# EAGLE schematic Exercise1 (EAGLE 6.5.0)
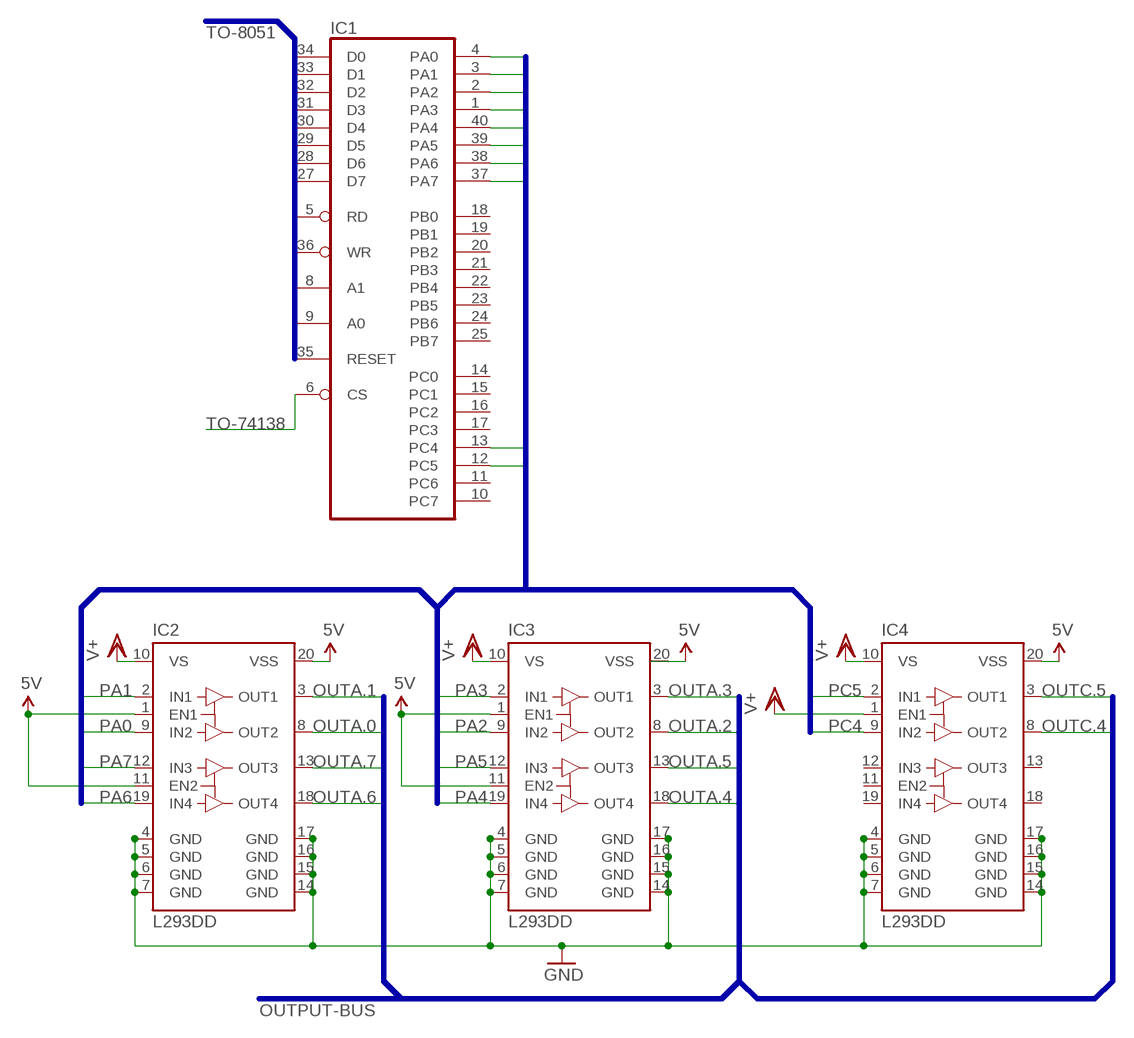
[diagram p0: schematic, sheet 1]

## Parts
IC1  8255A  [DIL40]
IC2  L293DD  [SO20]
IC3  L293DD  [SO20]
IC4  L293DD  [SO20]

## Nets
5V: IC2.1(EN1) IC2.11(EN2) IC2.20(VSS) IC3.1(EN1) IC3.11(EN2) IC3.20(VSS) IC4.20(VSS)
GND: IC2.4(GND) IC2.5(GND) IC2.6(GND) IC2.7(GND) IC2.14(GND) IC2.15(GND) IC2.16(GND) IC2.17(GND) IC3.4(GND) IC3.5(GND) IC3.6(GND) IC3.7(GND) IC3.14(GND) IC3.15(GND) IC3.16(GND) IC3.17(GND) IC4.4(GND) IC4.5(GND) IC4.6(GND) IC4.7(GND) IC4.14(GND) IC4.15(GND) IC4.16(GND) IC4.17(GND)
N$1: IC1.1(PA3) IC1.2(PA2) IC1.3(PA1) IC1.4(PA0) IC1.12(PC5) IC1.13(PC4) IC1.37(PA7) IC1.38(PA6) IC1.39(PA5) IC1.40(PA4)
OUTA.0: IC2.8(OUT2)
OUTA.1: IC2.3(OUT1)
OUTA.2: IC3.8(OUT2)
OUTA.3: IC3.3(OUT1)
OUTA.4: IC3.18(OUT4)
OUTA.5: IC3.13(OUT3)
OUTA.6: IC2.18(OUT4)
OUTA.7: IC2.13(OUT3)
OUTC.4: IC4.8(OUT2)
OUTC.5: IC4.3(OUT1)
PA0: IC2.9(IN2)
PA1: IC2.2(IN1)
PA2: IC3.9(IN2)
PA3: IC3.2(IN1)
PA4: IC3.19(IN4)
PA5: IC3.12(IN3)
PA6: IC2.19(IN4)
PA7: IC2.12(IN3)
PC4: IC4.9(IN2)
PC5: IC4.2(IN1)
TO-74138: IC1.6(CS)
VDD: IC2.10(VS) IC3.10(VS) IC4.1(EN1) IC4.10(VS) ; supply symbol labelled V+
Unconnected: IC1.5(RD) IC1.8(A1) IC1.9(A0) IC1.10(PC7) IC1.11(PC6) IC1.14(PC0) IC1.15(PC1) IC1.16(PC2) IC1.17(PC3) IC1.18(PB0) IC1.19(PB1) IC1.20(PB2) IC1.21(PB3) IC1.22(PB4) IC1.23(PB5) IC1.24(PB6) IC1.25(PB7) IC1.27(D7) IC1.28(D6) IC1.29(D5) IC1.30(D4) IC1.31(D3) IC1.32(D2) IC1.33(D1) IC1.34(D0) IC1.35(RESET) IC1.36(WR) IC4.11(EN2) IC4.12(IN3) IC4.13(OUT3) IC4.18(OUT4) IC4.19(IN4)

## Buses
TO-8051
OUTPUT-BUS
B$1

## Power pins joined to a net without a drawn wire
GND: IC1.7(GND)
VCC: IC1.26(VCC)

## Library data of the parts
IC1 = micro-intel:8255A: MICROCOMPUTER/PERIPHERAL DEVICE; OC_FARNELL: unknown; OC_NEWARK: unknown
IC2-IC4 = st-microelectronics:L293DD: PUSH-PULL FOUR CHANNEL DRIVER WITH DIODES Source: http://www.st.com/stonline/books/pdf/docs/1330.pdf; OC_FARNELL: unknown